# EAGLE design Motor_Driver (EAGLE 7.7.0)
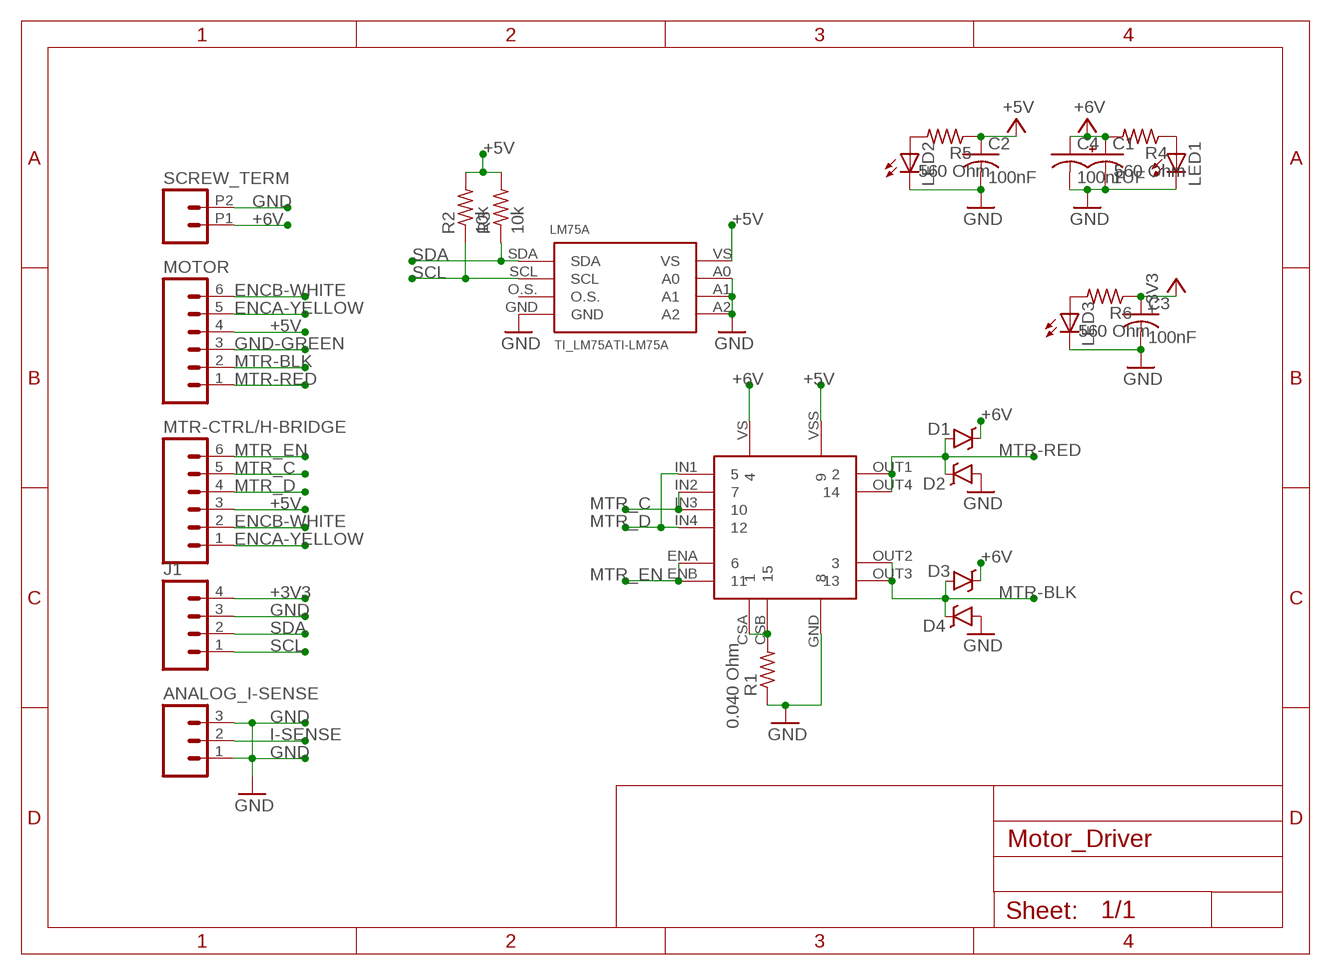
[diagram p0: schematic, sheet 1]

## Parts
ANALOG_I-SENSE  M03PTH  [1X03]
C1  1UF  1UF-50V-20%(PTH)KIT  [CPOL-RADIAL-1UF-50V-KIT]
C2  100nF  C-USC1206  [C1206]
C3  100nF  C-USC1206  [C1206]
C4  100nF  C-USC1206  [C1206]
D1  B340A  DIODE-SCHOTTKY-B340A  [SMA-DIODE]
D2  B340A  DIODE-SCHOTTKY-B340A  [SMA-DIODE]
D3  B340A  DIODE-SCHOTTKY-B340A  [SMA-DIODE]
D4  B340A  DIODE-SCHOTTKY-B340A  [SMA-DIODE]
J1  M04PTH  [1X04]
LED1  LEDSMT1206  [1206]
LED2  LEDSMT1206  [1206]
LED3  LEDSMT1206  [1206]
LM75A  TI_LM75ATI-LM75A  [TI_LM75A]
MOTOR  M06SILK_FEMALE_PTH  [1X06]
MTR-CTRL/H-BRIDGE  M06SILK_FEMALE_PTH  [1X06]
R1  0.040 Ohm  R-US_M0805  [M0805]
R2  10k  R-US_M1206  [M1206]
R3  10k  R-US_M1206  [M1206]
R4  560 Ohm  R-US_M0805  [M0805]
R5  560 Ohm  R-US_M0805  [M0805]
R6  560 Ohm  R-US_M0805  [M0805]
SCREW_TERM  M022.54MM_SCREWTERM  [1X02_2.54_SCREWTERM]
U$1  STL298N  [STL298N]

## Nets
+3V3: C3.1 J1.4 R6.1
+5V: C2.1 LM75A.VS MOTOR.4 MTR-CTRL/H-BRIDGE.3 R2.2 R3.2 R5.1 U$1.VSS
+6V: C1.1(+) C4.1 D1.C D3.C R4.2 SCREW_TERM.P1 U$1.VS
ENCA-YELLOW: MOTOR.5 MTR-CTRL/H-BRIDGE.1
ENCB-WHITE: MOTOR.6 MTR-CTRL/H-BRIDGE.2
GND: ANALOG_I-SENSE.1 ANALOG_I-SENSE.3 C1.2(-) C2.2 C3.2 C4.2 D2.A D4.A J1.3 LED1.C LED2.C LED3.C LM75A.A0 LM75A.A1 LM75A.A2 LM75A.GND R1.1 SCREW_TERM.P2 U$1.GND
GND-GREEN: MOTOR.3
I-SENSE: ANALOG_I-SENSE.2
MTR-BLK: D3.A D4.C MOTOR.2 U$1.OUT2 U$1.OUT3
MTR-RED: D1.A D2.C MOTOR.1 U$1.OUT1 U$1.OUT4
MTR_C: MTR-CTRL/H-BRIDGE.5 U$1.IN2 U$1.IN3
MTR_D: MTR-CTRL/H-BRIDGE.4 U$1.IN1 U$1.IN4
MTR_EN: MTR-CTRL/H-BRIDGE.6 U$1.ENA U$1.ENB
N$1: R1.2 U$1.CSA U$1.CSB
N$2: LED1.A R4.1
N$3: LED2.A R5.2
N$4: LED3.A R6.2
SCL: J1.1 LM75A.SCL R2.1
SDA: J1.2 LM75A.SDA R3.1
Unconnected: LM75A.O.S.

## Library data of the parts
ANALOG_I-SENSE = SparkFun-Connectors:M03: Header 3 Standard 3-pin 0.1" header. Use with straight break away headers (SKU : PRT-00116), right angle break away headers (PRT-00553), swiss pins (PRT-00743), machine pins (PRT-00117), and female headers (PRT-00115). Molex polarized connector foot print use with SKU : PRT-08232 with associated crimp pins and housings.
C1 = MORE_CAPS:1UF-50V-20%(PTH): CAP ALUM 1UF 20% 50V RADIAL; PROD_ID: USR1H010MDD
C2-C4 = rcl:C-US: CAPACITOR, American symbol
D1-D4 = SparkFun-DiscreteSemi:DIODE-SCHOTTKY: Schottky diodes in SFE's production catalog BAT20J 1A 23V 0.62Vf RB751 120mA 40V 0.37Vf PMEG4005EJ 0.5A 40V 0.42Vf MBRA140 1A 40V 0.5Vf B340A 3A 40V SMA; PROD_ID: DIO-09886
J1 = SparkFun-Connectors:M04: Header 4 Standard 4-pin 0.1" header. Use with straight break away headers (SKU : PRT-00116), right angle break away headers (PRT-00553), swiss pins (PRT-00743), machine pins (PRT-00117), and female headers (PRT-00115). Molex polarized connector foot print use with SKU : PRT-08231 with associated crimp pins and housings. 1MM SMD Version SKU: PRT-10208; PROD_ID: CONN-09696
LED1-LED3 = led:LED: LED OSRAM: - CHIPLED LG R971, LG N971, LY N971, LG Q971, LY Q971, LO R971, LY R971 LH N974, LH R974 LS Q976, LO Q976, LY Q976 LO Q996 - Hyper CHIPLED LW Q18S LB Q993, LB Q99A, LB R99A - SideLED LS A670, LO A670, LY A670, LG A670, LP A670 LB A673, LV A673, LT A673, LW A673 LH A674 LY A675 LS A676, LA A676, LO A676, LY A676, LW A676 LS A679, LY A679, LG A679 - Hyper Micro SIDELED® LS Y876, LA Y876, LO Y876, LY Y876 LT Y87S - SmartLED LW L88C, LW L88S LB L89C, LB L89S, LG L890 LS L89K, LO L89K, LY L89K LS L896, LA L896, LO L896, LY L896 - TOPLED LS T670, LO T670, LY T670, LG T670, LP T670 LSG T670, LSP T670, LSY T670, LOP T670, LYG T670 LG T671, LOG T671, LSG T671 LB T673, LV T673, LT T673, LW T673 LH T674 LS T676, LA T676, LO T676, LY T676, LB T676, LH T676, LSB T676, LW T676 LB T67C, LV T67C, LT T67C, LS T67K, LO T67K, LY T67K, LW E67C LS E67B, LA E67B, LO E67B, LY E67B, LB E67C, LV E67C, LT E67C LW T67C LS T679, LY T679, LG T679 LS T770, LO T770, LY T770, LG T770, LP T770 LB T773, LV T773, LT T773, LW T773 LH T774 LS E675, LA E675, LY E675, LS T675 LS T776, LA T776, LO T776, LY T776, LB T776 LHGB T686 LT T68C, LB T68C - Hyper Mini TOPLED® LB M676 - Mini TOPLED Santana® LG M470 LS M47K, LO M47K, LY M47K Source: http://www.osram.convergy.de LUXEON: - LUMILED® LXK2-PW12-R00, LXK2-PW12-S00, LXK2-PW14-U00, LXK2-PW14-V00 LXK2-PM12-R00, LXK2-PM12-S00, LXK2-PM14-U00 LXK2-PE12-Q00, LXK2-PE12-R00, LXK2-PE12-S00, LXK2-PE14-T00, LXK2-PE14-U00 LXK2-PB12-K00, LXK2-PB12-L00, LXK2-PB12-M00, LXK2-PB14-N00, LXK2-PB14-P00, LXK2-PB14-Q00 LXK2-PR12-L00, LXK2-PR12-M00, LXK2-PR14-Q00, LXK2-PR14-R00 LXK2-PD12-Q00, LXK2-PD12-R00, LXK2-PD12-S00 LXK2-PH12-R00, LXK2-PH12-S00 LXK2-PL12-P00, LXK2-PL12-Q00, LXK2-PL12-R00 Source: www.luxeon.com KINGBRIGHT: KA-3528ASYC Source: www.kingbright.com
LM75A = TI-LM75A:TI_LM75A: 8pin SPI Flash series x25xx. Works with devices like W25X32 and BR25L32
MOTOR MTR-CTRL/H-BRIDGE = SparkFun-Connectors:M06: Header 6 Standard 6-pin 0.1" header. Use with straight break away headers (SKU : PRT-00116), right angle break away headers (PRT-00553), swiss pins (PRT-00743), machine pins (PRT-00117), and female headers (PRT-00115). Molex polarized connector foot print use with SKU : PRT-08094 with associated crimp pins and housings. NOTES ON THE VARIANTS LOCK and LOCK_LONGPADS... This footprint was designed to help hold the alignment of a through-hole component (i.e. 6-pin header) while soldering it into place. You may notice that each hole has been shifted either up or down by 0.005 of an inch from it's more standard position (which is a perfectly straight line). This slight alteration caused the pins (the squares in the middle) to touch the edges of the holes. Because they are alternating, it causes a "brace" to hold the component in place. 0.005 has proven to be the perfect amount of "off-center" position when using our standard breakaway headers. Although looks a little odd when you look at the bare footprint, once you have a header in there, the alteration is very hard to notice. Also,if you push a header all the way into place, it is covered up entirely on the bottom side. This idea of altering the position of holes to aid alignment will be further integrated into the Sparkfun Library for other footprints. It can help hold any component with 3 or more connection pins.; PROD_ID: CONN-08437
R1-R6 = rcl:R-US_: RESISTOR, American symbol
SCREW_TERM = SparkFun-Connectors:M02: Standard 2-pin 0.1" header. Use with - straight break away headers ( PRT-00116) - right angle break away headers (PRT-00553) - swiss pins (PRT-00743) - machine pins (PRT-00117) - female headers (PRT-00115) Molex polarized connector foot print use with: PRT-08233 with associated crimp pins and housings. 2.54_SCREWTERM for use with PRT-10571. 3.5mm Screw Terminal footprints for PRT-08084 5mm Screw Terminal footprints for use with PRT-08432
U$1 = ST-L298N:STL298N

## Net classes
0 default: width 0.305 mm, drill 0.508 mm, clearance 0.254 mm

## Board
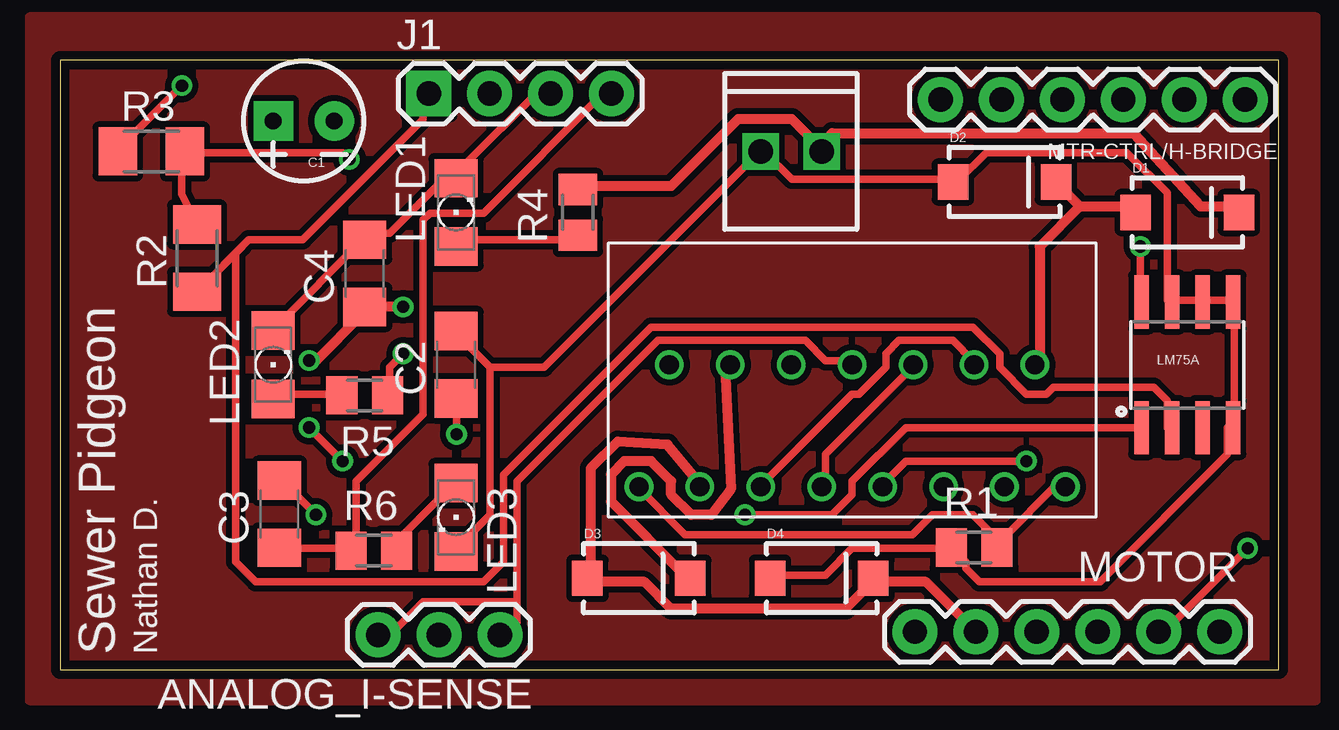
[diagram p1: board, top side]
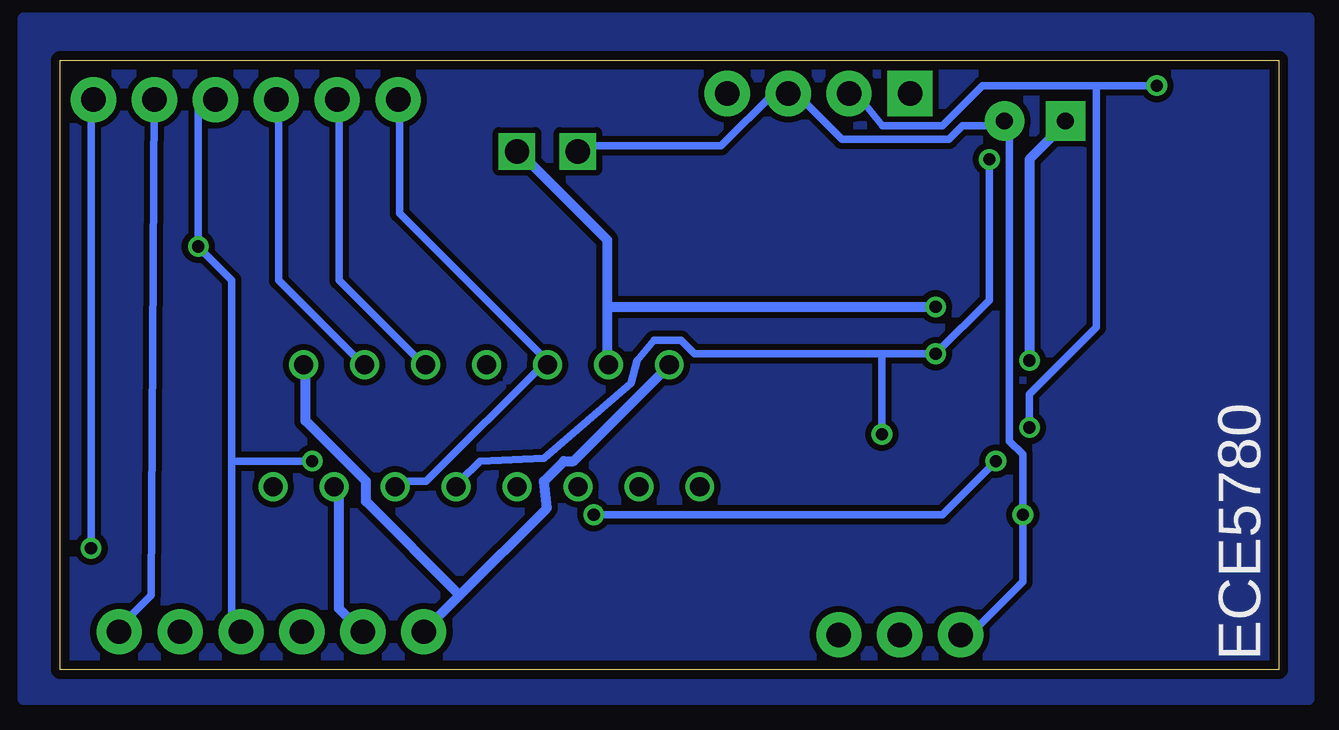
[diagram p2: board, bottom side, seen from below]

Size 50.8 x 25.4 mm. Coordinates in mm from the lower left corner, seen from the top.
Outline: 0,0 50.8,0 50.8,25.4 0,25.4 0,0
Copper layers (1*16): Top 0.0356mm / dielectric 1.5011mm / Bottom 0.0356mm
Design rules "oshpark-2layer": minimum track width 6mil, minimum drill 13mil, track to track 6mil, track to pad 6mil, pad to pad 6mil, via to via 6mil, smd to smd 6mil, copper to edge 15mil, drill to drill 6mil, minimum pad ring 7mil, minimum via ring 7mil, stop-mask expansion 2.5mil, vias tented up to drill 0mil, thermal gap 10mil

### Footprints (pad centres in the part's own frame; a part is rotated, then mirrored left to right if it is on the bottom)
1X03 = drill 1.016 pad 1.88: 1 0,0; 2 2.54,0; 3 5.08,0
CPOL-RADIAL-1UF-50V-KIT = drill 0.7 pad 1.651 square: 1 1.27,0 | drill 0.7 pad 1.651: 2 -1.27,0
C1206 = smd 1.6 x 1.8: 1 -1.4,0; 2 1.4,0
SMA-DIODE = smd 1.27 x 1.47: A -2.15,0; C 2.15,0
1X04 = drill 1.016 pad 1.88 square: 1 0,0 | drill 1.016 pad 1.88: 2 2.54,0; 3 5.08,0; 4 7.62,0
1206 = smd 1.6 x 1.803: A -1.422,0; C 1.422,0
TI_LM75A = smd 0.61 x 2.21: A0 -0.635,2.616; A1 0.635,2.616; A2 1.905,2.616; GND 1.905,-2.616; O.S. 0.635,-2.616; SCL -0.635,-2.616; SDA -1.905,-2.616; VS -1.905,2.616
1X06 = drill 1.016 pad 1.88: 1 0,0; 2 2.54,0; 3 5.08,0; 4 7.62,0; 5 10.16,0; 6 12.7,0
M0805 = smd 1.3 x 1.6: 1 -0.95,0; 2 0.95,0
M1206 = smd 1.6 x 2: 1 -1.4,0; 2 1.4,0
1X02_2.54_SCREWTERM = drill 1.016 square: P1 2.54,0; P2 0,0
STL298N = drill 0.8: CSA -7.62,-2.54; CSB 10.16,-2.54; ENA -1.27,2.54; ENB 5.08,-2.54; GND 1.27,2.54; IN1 -2.54,-2.54; IN2 0,-2.54; IN3 3.81,2.54; IN4 6.35,2.54; OUT1 -6.35,2.54; OUT2 -5.08,-2.54; OUT3 7.62,-2.54; OUT4 8.89,2.54; VS -3.81,2.54; VSS 2.54,-2.54

### Placement (x,y rotation side)
ANALOG_I-SENSE  18.34,1.45 180 top
C1  10.16,22.86 180 top
C2  16.51,12.7 90 top
C3  9.14,6.48 90 top
C4  12.7,16.51 90 top
D1  46.99,19.05 0 top
D2  39.37,20.32 0 top
D3  24.13,3.81 0 top
D4  31.75,3.81 0 top
J1  15.37,24 0 top
LED1  16.51,19.05 90 top
LED2  8.89,12.7 90 top
LED3  16.51,6.35 270 top
LM75A  46.99,12.7 0 top
MOTOR  35.64,1.58 0 top
MTR-CTRL/H-BRIDGE  49.4,23.75 180 top
R1  38.1,5.08 0 top
R2  5.71,17.15 90 top
R3  3.81,21.59 0 top
R4  21.59,19.05 90 top
R5  12.7,11.43 180 top
R6  13.08,4.95 0 top
SCREW_TERM  29.21,21.59 0 top
U$1  31.75,10.16 0 top

### Tracks (layer width: path | path; a pad name or v marks a point on that pad's centre or on a via)
+3V3
  Top 0.305: C3.1 9.27,5.05 12.06,5.05 R6.1 12.34,5.05 12.34,7.85 15.14,10.64 15.14,18.75 15.42,19.02 17.65,19.02 22.68,24.05 J1.4
+5V  (via drill 0.51)
  Top 0.305: v45.03,17.63 45.03,15.39 LM75A.VS | R2.2 5.08,19.81 5.08,21.54 R3.2 5.36,21.54 11.79,21.54 v12.06,21.26 | v14.3,13.16 13.74,12.6 13.74,11.48 R5.1 | v16.54,9.8 16.54,11.2 C2.1 | v40.28,8.69 35.26,8.69 34.42,7.85 U$1.VSS
  Bottom 0.305: MTR-CTRL/H-BRIDGE.3 44.48,24.05 45.03,23.5 v45.03,17.63 43.64,16.23 43.64,8.69 | 43.64,8.69 43.64,1.7 MOTOR.4 | 16.54,13.16 24.36,13.16 24.92,13.72 26.03,13.72 26.75,12.88 27,11.94 30.63,8.81 33.3,8.69 34.14,7.85 U$1.VSS | 16.54,13.16 v14.3,13.16 12.06,15.39 v12.06,21.26 | 16.54,13.16 v16.54,9.8 | v40.28,8.69 43.64,8.69
+6V  (via drill 0.51)
  Top 0.406: v10.39,12.88 10.67,12.88 12.62,14.83 C4.1 12.9,15.11 v14.3,15.11 | D3.C 26.03,3.94 22.96,7.01 22.96,8.13 23.52,8.69 24.64,8.69 25.48,7.85 25.48,7.29 26.31,6.45 27.15,6.45 27.96,7.52 27.71,12.6 U$1.VS | D1.C 48.95,19.3 47.55,19.3 44.76,22.35 32.18,22.35 31.9,21.82 SCREW_TERM.P1 31.62,21.82 30.51,22.94 28.27,22.94 25.48,20.14 21.84,20.14 R4.2
  Bottom 0.406: v10.39,12.88 10.39,21.26 8.99,22.66 C1.1 | 27.99,15.11 27.99,17.91 31.62,21.54 SCREW_TERM.P1 | 27.99,15.11 27.99,12.88 U$1.VS | 27.99,15.11 v14.3,15.11
ENCA-YELLOW  (via drill 0.51)
  Top 0.305: v49.51,5.05 46.15,1.7 MOTOR.5
  Bottom 0.305: v49.51,5.05 49.51,24.05 MTR-CTRL/H-BRIDGE.1
ENCB-WHITE
  Bottom 0.305: MTR-CTRL/H-BRIDGE.2 46.99,3.1 48.39,1.7 MOTOR.6
GND  (via drill 0.51)
  Top 0.305: v10.67,6.45 9.27,7.85 C3.2 | 19.05,2.82 19.05,1.98 18.49,1.42 ANALOG_I-SENSE.1 | 19.05,2.82 19.05,7.85 24.92,13.72 31.06,13.72 31.9,12.88 33.02,12.88 U$1.GND | 19.05,2.82 15.14,2.82 13.74,1.42 13.18,1.42 ANALOG_I-SENSE.3 | D4.A 29.67,3.94 31.9,3.94 33.02,5.05 36.93,5.05 R1.1 37.21,5.05 37.77,4.5 37.77,4.22 38.33,3.66 43.36,3.66 48.67,8.97 48.67,10.08 LM75A.GND 48.95,10.08 48.95,15.11 LM75A.A2 48.67,15.39 47.83,15.39 LM75A.A1 47.55,15.39 46.43,15.39 LM75A.A0 46.15,15.39 46.15,19.86 44.48,21.54 38.61,21.54 37.49,20.42 D2.A 37.21,20.42 30.51,20.42 29.39,21.54 SCREW_TERM.P2 29.11,21.54 20.17,12.6 17.93,12.6 | LED2.C 8.99,14.27 12.62,17.91 C4.2 12.9,18.19 13.74,18.19 16.26,20.7 LED1.C 16.54,20.7 20.17,24.33 J1.3 | 17.93,12.6 16.54,14 C2.2 | 17.93,12.6 17.93,6.45 16.54,5.05 LED3.C
  Bottom 0.305: ANALOG_I-SENSE.3 12.9,1.42 10.67,3.66 v10.67,6.45 10.67,8.97 11.23,9.52 11.23,22.66 C1.2 11.51,22.66 13.18,22.66 13.74,22.1 18.21,22.1 20.17,24.05 J1.3 20.45,24.05 21.01,24.05 23.24,21.82 29.11,21.82 SCREW_TERM.P2
MTR-BLK
  Top 0.406: U$1.OUT2 26.59,7.85 25.32,9.37 23.24,9.5 22.12,8.38 22.12,3.94 D3.A 22.12,3.66 24.36,3.66 25.48,2.54 32.74,2.54 33.86,3.66 D4.C 34.14,3.66 36.09,3.66 MOTOR.2
  Bottom 0.406: U$1.OUT3 39.17,7.57 39.17,2.54 38.33,1.7 MOTOR.2
MTR-RED
  Top 0.406: 42.52,19.3 44.76,19.3 D1.A | 42.52,19.3 41.68,20.14 D2.C | 42.52,19.3 40.84,17.63 40.84,12.88 U$1.OUT4
  Bottom 0.406: 34.14,3.1 35.53,1.7 MOTOR.1 | 34.14,3.1 30.51,6.73 30.63,7.85 29.79,8.69 29.39,8.69 25.48,12.6 U$1.OUT1 | 34.14,3.1 38.05,7.01 38.05,7.85 40.56,10.36 40.56,12.6 U$1.OUT4
MTR_C
  Top 0.305: U$1.IN2 31.9,7.85 31.9,8.97 35.53,12.6 U$1.IN3
  Bottom 0.305: MTR-CTRL/H-BRIDGE.5 39.17,24.05 39.17,16.23 35.81,12.88 U$1.IN3
MTR_D
  Top 0.305: U$1.IN1 29.39,7.85 33.02,11.48 33.3,11.48 34.42,12.6 34.42,13.16 34.98,13.72 37.21,13.72 38.05,12.88 U$1.IN4
  Bottom 0.305: MTR-CTRL/H-BRIDGE.4 41.68,24.05 41.68,16.23 38.33,12.88 U$1.IN4
MTR_EN
  Bottom 0.305: 30.51,12.88 35.53,7.85 36.65,7.85 U$1.ENB | 30.51,12.88 36.65,19.02 36.65,24.05 MTR-CTRL/H-BRIDGE.6 | 30.51,12.88 U$1.ENA
N$1
  Top 0.305: 39.17,5.33 41.68,7.85 U$1.CSB | 39.17,5.33 38.05,6.45 36.37,6.45 35.53,5.61 26.06,5.61 24.1,7.57 U$1.CSA | 39.17,5.33 R1.2
N$2
  Top 0.305: R4.1 21.56,17.91 16.54,17.91 LED1.A
N$3
  Top 0.305: R5.2 11.51,11.48 8.99,11.48 LED2.A
N$4
  Top 0.305: R6.2 14.3,5.05 14.3,5.61 16.26,7.57 LED3.A
N$5
  pour Bottom: -1.27,27.18 -1.27,-1.27 52.35,-1.27 52.35,27.18
N$6
  pour Top: -1.27,27.18 -1.27,-1.27 52.35,-1.27 52.35,27.18
SCL
  Top 0.305: J1.1 15.14,24.05 15.14,22.94 10.11,17.91 7.87,17.91 R2.1 7.59,17.63 7.31,17.35 7.31,4.5 8.15,3.66 17.65,3.66 18.49,4.5 18.49,8.13 24.64,14.27 38.05,14.27 39.17,13.16 39.17,12.6 40.28,11.48 41.12,11.48 41.4,11.76 45.59,11.76 46.15,11.2 46.15,10.08 LM75A.SCL
SDA  (via drill 0.51)
  Top 0.305: v5.08,24.33 2.56,21.82 R3.1 | LM75A.SDA 35.26,10.08 33.02,7.85 33.02,7.29 32.18,6.45 v28.55,6.45 | v10.39,10.08 v11.79,8.69
  Bottom 0.305: 7.59,24.33 12.34,24.33 14.02,22.66 16.51,22.66 17.65,24.05 J1.2 | 7.59,24.33 v5.08,24.33 | v28.55,6.45 14.02,6.45 v11.79,8.69 | v10.39,10.08 10.39,11.48 7.59,14.27 7.59,24.33

### Text on the board
tNames: Sewer Pidgeon | Nathan D.
bNames: ECE5780